# EAGLE schematic chlorophyll_analyzer (EAGLE 9.4.2)
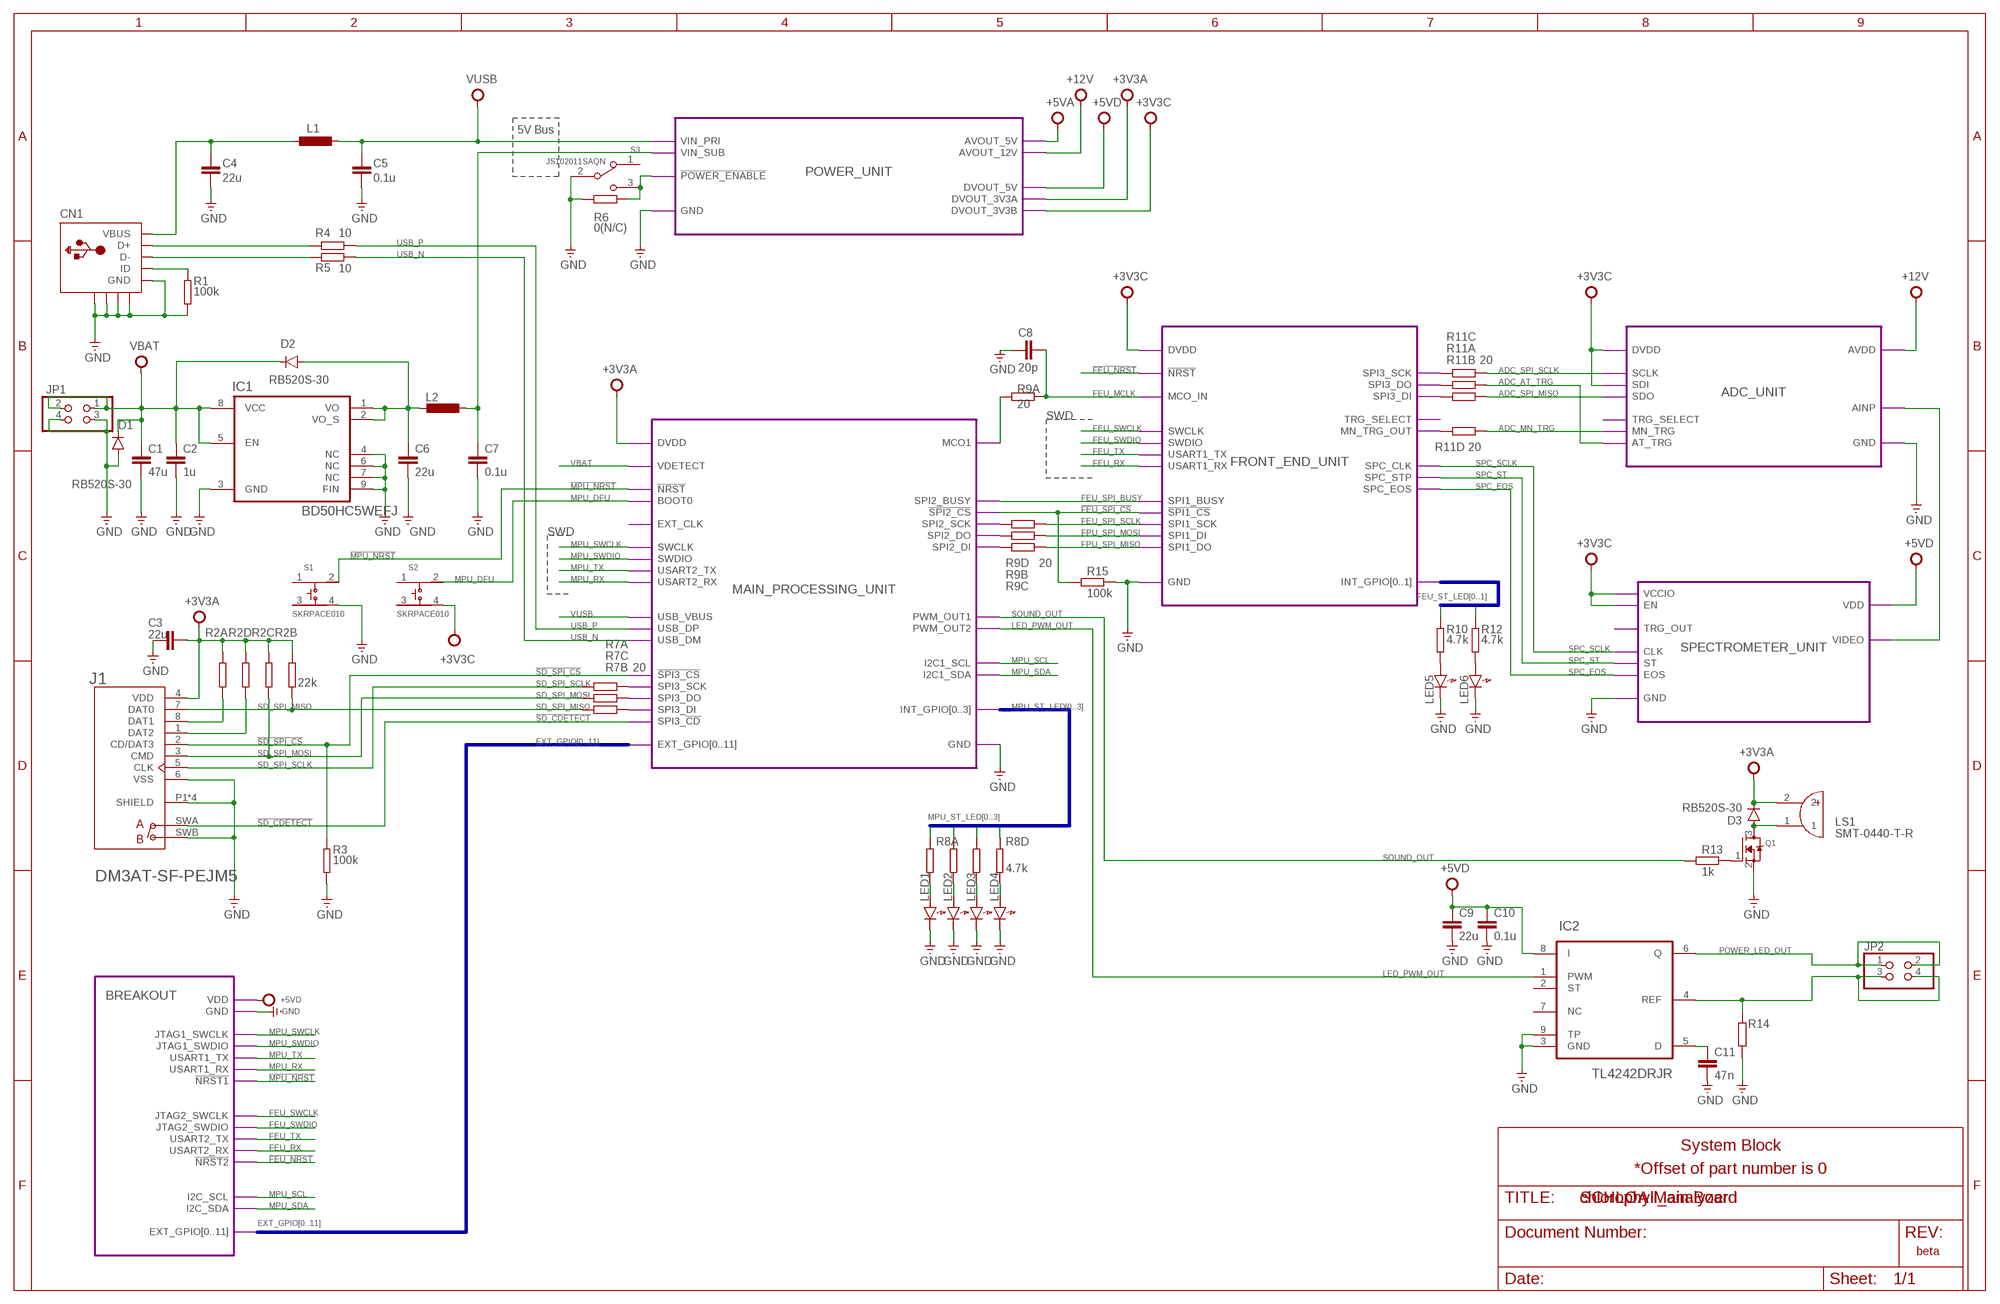
[diagram p0: schematic, sheet 1]

## Parts
C1  47u  C-EUC1206  [C1206]
C2  1u  C-EUC0603K  [C0603K]
C3  22u  C-EUC0603K  [C0603K]
C4  22u  C-EUC0603K  [C0603K]
C5  0.1u  C-EUC0603K  [C0603K]
C6  22u  C-EUC0603K  [C0603K]
C7  0.1u  C-EUC0603K  [C0603K]
C8  20p  C-EUC0603K  [C0603K]
C9  22u  C-EUC0603K  [C0603K]
C10  0.1u  C-EUC0603K  [C0603K]
C11  47n  C-EUC0603K  [C0603K]
CN1  USBMINIB  [USB-MINIB]
D1  RB520S-30  DIODE-SOD523  [SOD523]
D2  RB520S-30  DIODE-SOD523  [SOD523]
D3  RB520S-30  DIODE-SOD523  [SOD523]
IC1  BD50HC5WEFJ  BDXXHC5WEFJ  [HTSOP-J8]
IC2  TL4242DRJR  [SON80P410X410X80-9N]
J1  DM3AT-SF-PEJM5  [HRS_DM3AT-SF-PEJM5]
JP1  PINHD-2X2  [2X02]
JP2  PINHD-2X2  [2X02]
L1  INDUCOR2012  [SMD2012]
L2  INDUCOR2012  [SMD2012]
LED1  LED1608  [LED1608]
LED2  LED1608  [LED1608]
LED3  LED1608  [LED1608]
LED4  LED1608  [LED1608]
LED5  LED1608  [LED1608]
LED6  LED1608  [LED1608]
LS1  SMT-0440-T-R  [XDCR_SMT-0440-T-R]
Q1  MOSFET-NREFLOW  [SOT23]
R1  100k  RESISTOR1608  [SMD1608]
R2  22k  RESISTOR_ARRY1206  [RESCAXS80P320X160X60-8N]
R3  100k  RESISTOR1608  [SMD1608]
R4  10  RESISTOR1608  [SMD1608]
R5  10  RESISTOR1608  [SMD1608]
R6  0(N/C)  RESISTOR1608  [SMD1608]
R7  20  RESISTOR_ARRY1206  [RESCAXS80P320X160X60-8N]
R8  4.7k  RESISTOR_ARRY1206  [RESCAXS80P320X160X60-8N]
R9  20  RESISTOR_ARRY1206  [RESCAXS80P320X160X60-8N]
R10  4.7k  RESISTOR1608  [SMD1608]
R11  20  RESISTOR_ARRY1206  [RESCAXS80P320X160X60-8N]
R12  4.7k  RESISTOR1608  [SMD1608]
R13  1k  RESISTOR1608  [SMD1608]
R14  R-EU_R1206  [R1206]
R15  100k  RESISTOR1608  [SMD1608]
S1  SKRPACE010  [SW_SKRPACE010]
S2  SKRPACE010  [SW_SKRPACE010]
S3  JS102011SAQN  [SW_JS102011SAQN]

## Module instances
ADC_UNIT = ADC_UNIT (part numbers offset by 500)
FRONT_END_UNIT = FRONT_END_UNIT (part numbers offset by 300)
POWER_UNIT = POWER_UNIT (part numbers offset by 100)
SPECTROMETER_UNIT = SPECTROMETER_UNIT (part numbers offset by 400)
MAIN_PROCESSING_UNIT = MAIN_PROCESSING_UNIT (part numbers offset by 200)
BREAKOUT = BREAKOUT (part numbers offset by 600)

## Nets
!FEU_NRST: port FRONT_END_UNIT.!NRST BREAKOUT.!NRST2
!FEU_SPI_CS: R15.1 ; port FRONT_END_UNIT.!SPI1_CS MAIN_PROCESSING_UNIT.!SPI2_CS
!MPU_NRST: S1.2 ; port MAIN_PROCESSING_UNIT.!NRST BREAKOUT.!NRST1
!SD_CDETECT: J1.SWA(A) ; port MAIN_PROCESSING_UNIT.SPI3_!CD
!SD_SPI_CS: J1.2(CD/DAT3) R3.1 ; port MAIN_PROCESSING_UNIT.!SPI3_CS
+3V3A: C3.1 D3.C J1.4(VDD) LS1.2 R2.5 R2.6 R2.7 R2.8 ; port POWER_UNIT.DVOUT_3V3A MAIN_PROCESSING_UNIT.DVDD
+3V3C: S2.4 ; port POWER_UNIT.DVOUT_3V3B ADC_UNIT.DVDD ADC_UNIT.SDI SPECTROMETER_UNIT.VCCIO SPECTROMETER_UNIT.EN FRONT_END_UNIT.DVDD
+5VA: port POWER_UNIT.AVOUT_5V
+5VD: C9.2 C10.2 IC2.8(I) ; port POWER_UNIT.DVOUT_5V BREAKOUT.VDD SPECTROMETER_UNIT.VDD
+12V: port POWER_UNIT.AVOUT_12V ADC_UNIT.AVDD
ADC_AT_TRG: R11.8 ; port ADC_UNIT.AT_TRG
ADC_MN_TRG: R11.5 ; port ADC_UNIT.MN_TRG
ADC_SPI_MISO: R11.7 ; port ADC_UNIT.SDO
ADC_SPI_SCLK: R11.6 ; port ADC_UNIT.SCLK
FEU_MCLK: C8.1 R9.8 ; port FRONT_END_UNIT.MCO_IN
FEU_RX: port FRONT_END_UNIT.USART1_RX BREAKOUT.USART2_RX
FEU_SPI_BUSY: port FRONT_END_UNIT.SPI1_BUSY MAIN_PROCESSING_UNIT.SPI2_BUSY
FEU_SPI_SCLK: R9.5 ; port FRONT_END_UNIT.SPI1_SCK
FEU_ST_LED0: R10.1
FEU_ST_LED1: R12.1
FEU_SWCLK: port FRONT_END_UNIT.SWCLK BREAKOUT.JTAG2_SWCLK
FEU_SWDIO: port FRONT_END_UNIT.SWDIO BREAKOUT.JTAG2_SWDIO
FEU_TX: port FRONT_END_UNIT.USART1_TX BREAKOUT.USART2_TX
FPU_SPI_MISO: R9.6 ; port FRONT_END_UNIT.SPI1_DO
FPU_SPI_MOSI: R9.7 ; port FRONT_END_UNIT.SPI1_DI
GND: C1.2 C2.2 C3.2 C4.2 C5.2 C6.2 C7.2 C8.2 C9.1 C10.1 C11.1 CN1.GND CN1.GND1 CN1.GND2 CN1.GND3 CN1.GND4 D1.A IC1.3(GND) IC1.4(NC) IC1.6(NC) IC1.7(NC) IC1.9(FIN) IC2.3(GND) IC2.9(TP) J1.6(VSS) J1.P1(SHIELD) J1.P2(SHIELD) J1.P3(SHIELD) J1.P4(SHIELD) J1.SWB(B) JP1.3 JP1.4 LED1.K LED2.K LED3.K LED4.K LED5.K LED6.K Q1.2(S) R1.2 R3.2 R6.1 R14.1 R15.2 S1.4 S3.2 ; port POWER_UNIT.GND ADC_UNIT.GND SPECTROMETER_UNIT.GND MAIN_PROCESSING_UNIT.GND FRONT_END_UNIT.GND BREAKOUT.GND
LED_PWM_OUT: IC2.1(PWM) ; port MAIN_PROCESSING_UNIT.PWM_OUT2
MPU_DFU: S2.2 ; port MAIN_PROCESSING_UNIT.BOOT0
MPU_RX: port MAIN_PROCESSING_UNIT.USART2_RX BREAKOUT.USART1_RX
MPU_SCL: port MAIN_PROCESSING_UNIT.I2C1_SCL BREAKOUT.I2C_SCL
MPU_SDA: port MAIN_PROCESSING_UNIT.I2C1_SDA BREAKOUT.I2C_SDA
MPU_ST_LED0: R8.1
MPU_ST_LED1: R8.2
MPU_ST_LED2: R8.3
MPU_ST_LED3: R8.4
MPU_SWCLK: port MAIN_PROCESSING_UNIT.SWCLK BREAKOUT.JTAG1_SWCLK
MPU_SWDIO: port MAIN_PROCESSING_UNIT.SWDIO BREAKOUT.JTAG1_SWDIO
MPU_TX: port MAIN_PROCESSING_UNIT.USART2_TX BREAKOUT.USART1_TX
N$1: LED1.A R8.8
N$2: LED2.A R8.7
N$3: LED3.A R8.6
N$4: LED4.A R8.5
N$5: J1.8(DAT1) R2.1
N$6: J1.1(DAT2) R2.4
N$7: C6.1 D2.A IC1.1(VO) IC1.2(VO_S) L2.2
N$8: LED5.A R10.2
N$9: Q1.1(G) R13.2
N$10: C4.1 CN1.VBUS L1.2
N$11: R6.2 S3.3 ; port POWER_UNIT.!POWER_ENABLE
N$12: LED6.A R12.2
N$13: C11.2 IC2.5(D)
N$14: D3.A LS1.1 Q1.3(D)
N$16: R9.4 ; port MAIN_PROCESSING_UNIT.SPI2_SCK
N$17: C7.1 L2.1 ; port POWER_UNIT.VIN_SUB
N$18: R7.8 ; port MAIN_PROCESSING_UNIT.SPI3_SCK
N$19: R7.6 ; port MAIN_PROCESSING_UNIT.SPI3_DO
N$20: IC2.4(REF) JP2.3 JP2.4 R14.2
N$21: port SPECTROMETER_UNIT.VIDEO ADC_UNIT.AINP
N$22: R7.7 ; port MAIN_PROCESSING_UNIT.SPI3_DI
N$23: R9.2 ; port MAIN_PROCESSING_UNIT.SPI2_DO
N$24: R9.3 ; port MAIN_PROCESSING_UNIT.SPI2_DI
N$25: R9.1 ; port MAIN_PROCESSING_UNIT.MCO1
N$26: R11.1 ; port FRONT_END_UNIT.SPI3_DO
N$27: R11.2 ; port FRONT_END_UNIT.SPI3_DI
N$28: R11.3 ; port FRONT_END_UNIT.SPI3_SCK
N$29: R11.4 ; port FRONT_END_UNIT.MN_TRG_OUT
N$30: CN1.ID R1.1
POWER_LED_OUT: IC2.6(Q) JP2.1 JP2.2
SD_SPI_MISO: J1.7(DAT0) R2.2 R7.2
SD_SPI_MOSI: J1.3(CMD) R2.3 R7.3
SD_SPI_SCLK: J1.5(CLK) R7.1
SOUND_OUT: R13.1 ; port MAIN_PROCESSING_UNIT.PWM_OUT1
SPC_EOS: port SPECTROMETER_UNIT.EOS FRONT_END_UNIT.SPC_EOS
SPC_SCLK: port SPECTROMETER_UNIT.CLK FRONT_END_UNIT.SPC_CLK
SPC_ST: port SPECTROMETER_UNIT.ST FRONT_END_UNIT.SPC_STP
USB_N: R5.2 ; port MAIN_PROCESSING_UNIT.USB_DM
USB_P: R4.2 ; port MAIN_PROCESSING_UNIT.USB_DP
USBC_N: CN1.D- R5.1
USBC_P: CN1.D+ R4.1
VBAT: C1.1 C2.1 D1.C D2.C IC1.5(EN) IC1.8(VCC) JP1.1 JP1.2 ; port MAIN_PROCESSING_UNIT.VDETECT
VUSB: C5.1 L1.1 ; port POWER_UNIT.VIN_PRI MAIN_PROCESSING_UNIT.USB_VBUS
Unconnected: IC2.2(ST) IC2.7(NC) R7.4 R7.5 S1.1 S1.3 S2.1 S2.3 S3.1

## Buses
MPU_ST_LED[0..3]
FEU_ST_LED[0..1]
EXT_GPIO[0..11]

## Notes on the sheet
- 5V Bus
- SWD
- SWD
- System Block
- *Offset of part number is 0
- SCHLOA Main Board
- beta

## Library data of the parts
C1-C11 = rcl:C-EU: CAPACITOR, European symbol; SPICEPREFIX: C
CN1 = adafruit:USB: USB Connectors USBMINIB - Surface Mount Female Mini-B USB Connector 4UConnector: 06564 By microbuilder.eu Thru-hole RA Female Mini-B USB Connector 4UConnector: 18732 By ladyada.net
D1-D3 = diode:DIODE-: DIODE
IC1 = BDxxHC5WEFJ:BDXXHC5WEFJ: 1.5A LDO Regulator
IC2 = TL4242DRJR:TL4242DRJR: ADJUSTABLE LED DRIVER; AVAILABILITY: Unavailable; DESCRIPTION: LED DRVR 5V/9V/12V/15V/18V/24V 8-Pin WSON EP T/R; MF: Texas Instruments; MP: TL4242DRJR; PACKAGE: WSON-8 Texas Instruments; PRICE: None
J1 = DM3AT-SF-PEJM5:DM3AT-SF-PEJM5: DM3 Series 8 Position Right Angle SMT Push Push Ejection MicroSD Card Connector; AVAILABILITY: Unavailable; DESCRIPTION: DM3 RA SMT microSD memory card push/push; MF: Hirose; MP: DM3AT-SF-PEJM5; PACKAGE: None; PRICE: None
JP1 JP2 = pinhead:PINHD-2X2: PIN HEADER
L1 L2 = Fugu_RCL:INDUCOR
LED1-LED6 = Fugu_RCL:LED: Generic LEDs
LS1 = SMT-0440-T-R:SMT-0440-T-R: Audio Indicator Transducer Electromagnetic 3Vpk 90mA Solder Pad 2Vpk 3500Hz to 4500Hz Surface Mount; DESCRIPTION: Audio Indicator Transducer Electromagnetic 3Vpk 90mA Solder Pad 2Vpk 3500Hz to 4500Hz Surface Mount; DIGI-KEY_PART_NUMBER: 668-1489-1-ND; DIGI-KEY_PURCHASE_URL: https://www.digikey.jp/product-detail/en/pui-audio-inc/SMT-0440-T-R/668-1489-1-ND/5113610?utm_source=snapeda&utm_medium=aggregator&utm_campaign=symbol; MF: PUI; MP: SMT-0440-T-R; PACKAGE: PUI
Q1 = adafruit:MOSFET-N: N-Channel Mosfet 2N7002E - 60V 260mA SOT23 [Digikey: 2N7002ET1GOSTR-ND] - REEL BSH103 - 30V 850mA SOT23 [Digikey: 568-5013-1-ND]
R1 R3-R6 R10 R12 R13 R15 = Fugu_RCL:RESISTOR: Generic Registor
R2 R9 = Fugu_RCL:RESISTOR_ARRY; SPICEPREFIX: R
R7 R8 R11 = Fugu_RCL:RESISTOR_ARRY
R14 = rcl:R-EU_: RESISTOR, European symbol; SPICEPREFIX: R
S1 S2 = SKRPACE010:SKRPACE010: Switch Tactile N.O. SPST Button J-Bend 0.05A 16VDC 2.55N SMD Automotive T/R; AVAILABILITY: Unavailable; DESCRIPTION: Switch Tactile N.O. SPST Button J-Bend 0.05A 16VDC 2.55N SMD Automotive T/R; MF: ALPS; MP: SKRPACE010; PACKAGE: None; PRICE: None; SPICEPREFIX: S
S3 = JS102011SAQN:JS102011SAQN: JS10 Series SPDT On-On 6 V 0.3 A Gull Wing SMT Slide Switch http://www.snapeda.com/parts/JS102011SAQN/C%26K%20Components/view-part/; AVAILABILITY: Unavailable; DESCRIPTION: JS10 Series SPDT On-On 6 V 0.3 A Gull Wing SMT Slide Switch; MF: C&K; MP: JS102011SAQN; PACKAGE: None; PRICE: None

## Module ADC_UNIT
Ports: SCLK(in) SDO(out) SDI(in) DVDD(pwr) AVDD(pwr) GND(pwr) TRG_SELECT(in) AT_TRG(in) MN_TRG(in) AINP(in)
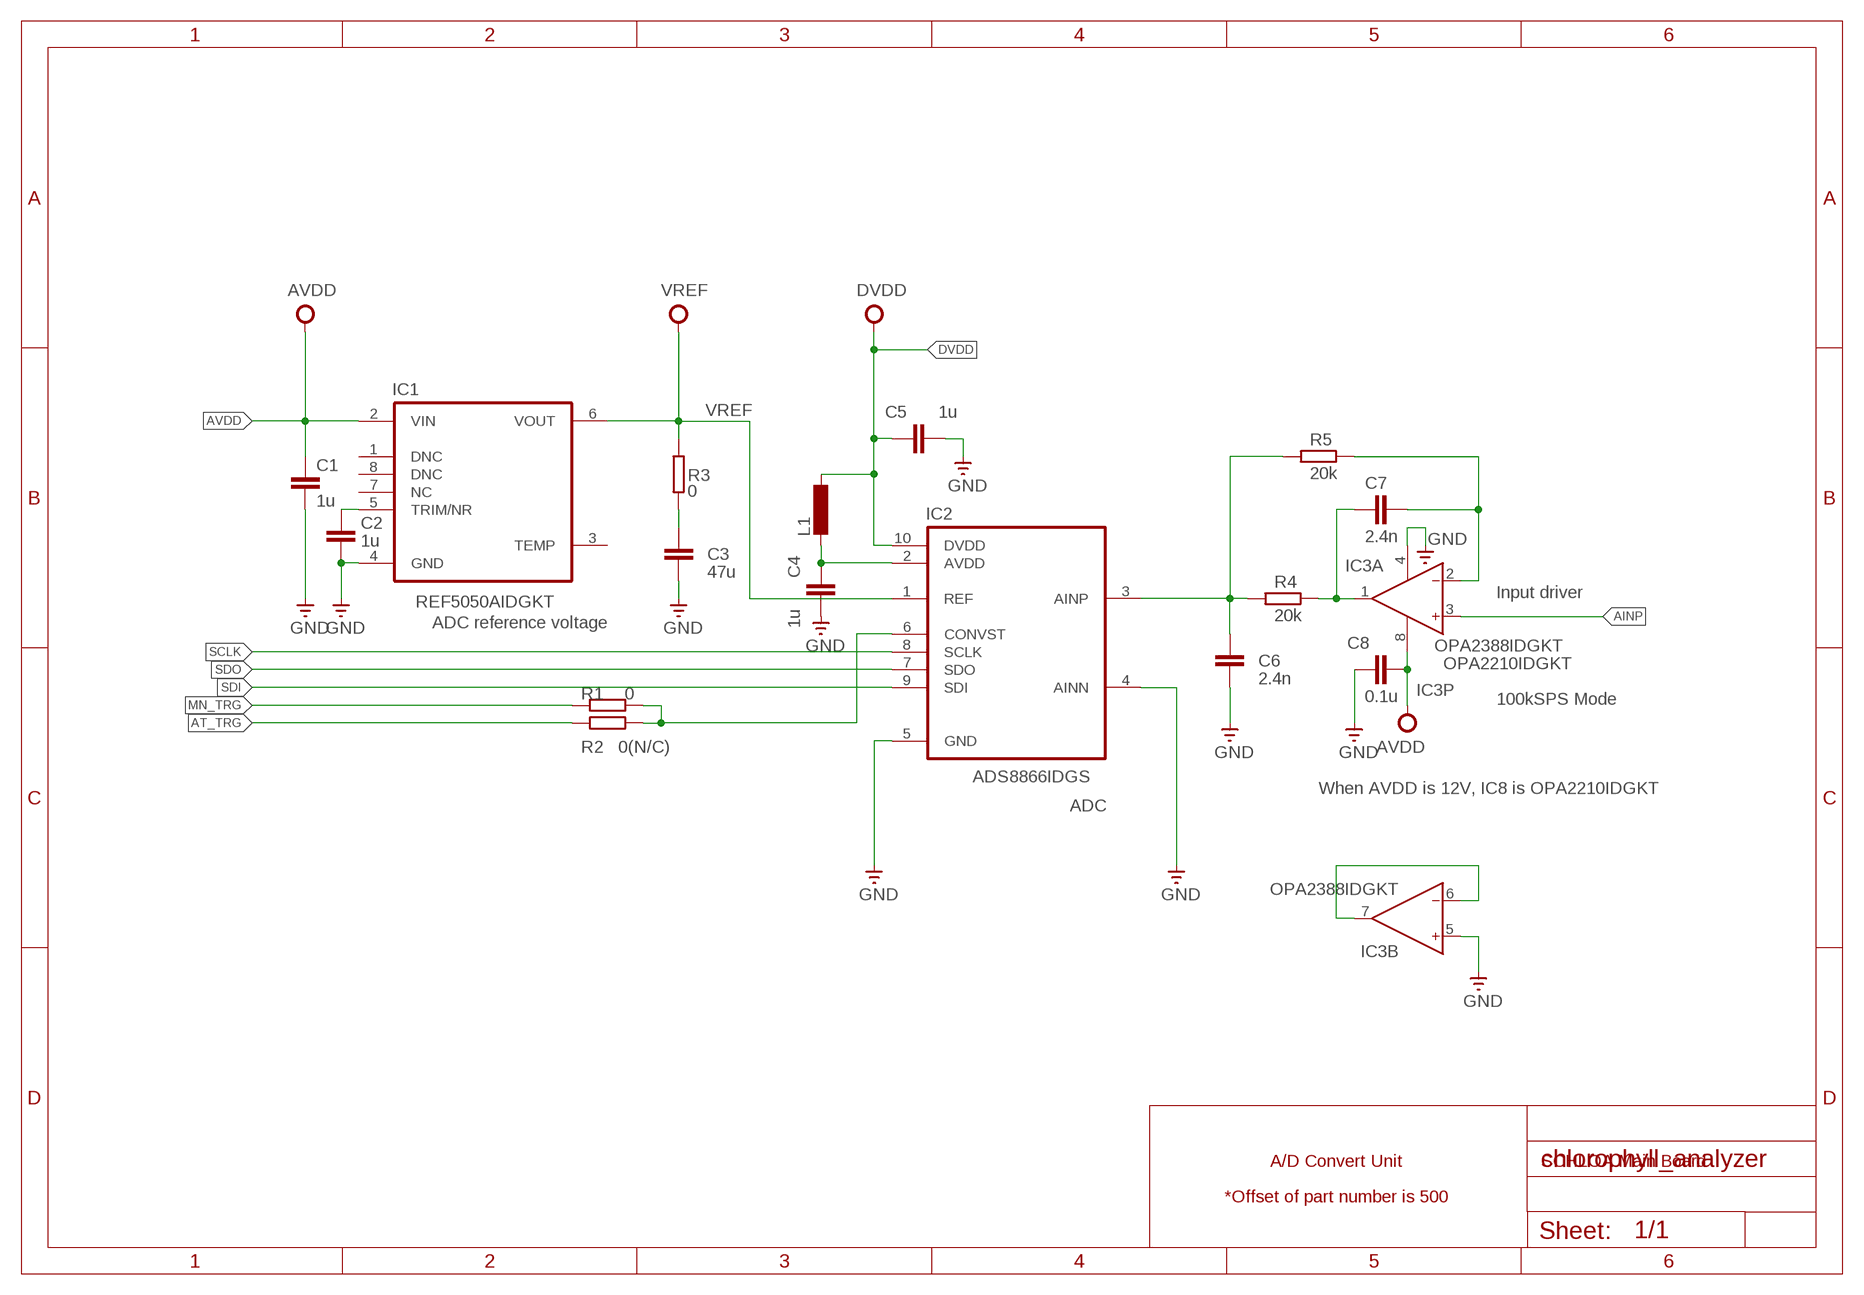
[diagram p1: schematic, module ADC_UNIT, sheet 1]

### Parts
C1  1u  C-EUC0603K  [C0603K]
C2  1u  C-EUC0603K  [C0603K]
C3  47u  C-EUC1206  [C1206]
C4  1u  C-EUC0603K  [C0603K]
C5  1u  C-EUC0603K  [C0603K]
C6  2.4n  C-EUC0603K  [C0603K]
C7  2.4n  C-EUC0603K  [C0603K]
C8  0.1u  C-EUC0603K  [C0603K]
IC1  REF5050AIDGKT  [SOP65P490X110-8N]
IC2  ADS8866IDGS  ADS8319IBDGSR  [SOP50P490X110-10N]
IC3  OPA2388IDGKT  [SOP65P490X110-9N]
L1  INDUCOR1608  [SMD1608]
R1  0  REGISTER1068  [SMD1608]
R2  0(N/C)  REGISTER1068  [SMD1608]
R3  0  RESISTOR1608  [SMD1608]
R4  20k  RESISTOR1608  [SMD1608]
R5  20k  RESISTOR1608  [SMD1608]

### Nets
ADC_CTRG: IC2.6(CONVST) R1.2 R2.2
AINP: IC3.3(A:IN+)
AT_TRG: R2.1
AVDD: C1.1 C8.1 IC1.2(VIN) IC3.8(P:V+)
DVDD: C5.1 IC2.10(DVDD) L1.1
GND: C1.2 C2.2 C3.1 C4.2 C5.2 C6.2 C8.2 IC1.4(GND) IC2.4(AINN) IC2.5(GND) IC3.4(P:V-) IC3.5(B:IN+)
MN_TRG: R1.1
N$1: C3.2 R3.1
N$2: IC3.6(B:IN-) IC3.7(B:OUT)
N$3: C4.1 IC2.2(AVDD) L1.2
N$25: C6.1 IC2.3(AINP) R4.1 R5.1
N$26: C7.1 IC3.1(A:OUT) R4.2
N$30: C7.2 IC3.2(A:IN-) R5.2
N$34: C2.1 IC1.5(TRIM/NR)
SCLK: IC2.8(SCLK)
SDI: IC2.9(SDI)
SDO: IC2.7(SDO)
VREF: IC1.6(VOUT) IC2.1(REF) R3.2
Unconnected: IC1.1(DNC) IC1.3(TEMP) IC1.7(NC) IC1.8(DNC)

### Notes on the sheet
- Input driver
- ADC reference voltage
- OPA2210IDGKT
- 100kSPS Mode
- When AVDD is 12V, IC8 is OPA2210IDGKT
- ADC
- A/D Convert Unit | SCHLOA Main Board
- *Offset of part number is 500

### Library data of the parts
C1-C8 = rcl:C-EU: CAPACITOR, European symbol; SPICEPREFIX: C
IC1 = REF5050AIDGKT:REF5050AIDGKT: VOLTAGE REFERENCE; AVAILABILITY: Unavailable; DESCRIPTION: VOLTAGE REFERENCE, SERIES, 5V, MSOP-8; Topology: Series; Input Voltage Min: 5.2V;; MF: Texas Instruments; MP: REF5050AIDGKT; PACKAGE: MSOP-8 Texas Instruments; PRICE: None; SPICEPREFIX: X
IC2 = ADS8319IBDGSR:ADS8319IBDGSR: ADC; DESCRIPTION: Precision 16-Bit SAR w/ SPI interface in MSOP-10 10-VSSOP -40 to 85; DIGI-KEY_PART_NUMBER: ADS8319IBDGSR-ND; DIGI-KEY_PURCHASE_URL: https://www.digikey.com/product-detail/en/texas-instruments/ADS8319IBDGSR/ADS8319IBDGSR-ND/2047198?utm_source=snapeda&utm_medium=aggregator&utm_campaign=symbol; MF: Texas Instruments; MP: ADS8319IBDGSR; PACKAGE: MSOP-10 Texas Instruments
IC3 = OPA2388IDGKT:OPA2388IDGKT: Single Supplｙ True Rail-to-Rail Operational Amplifiers; AVAILABILITY: Uavailable; MF: Texsas Instruments; MP: OPA2388IDGKT; PACKAGE: MSOP-8 Texas Instruments; PRICE: None
L1 = Fugu_RCL:INDUCOR
R1 = Fugu_Generic:REGISTER
R2 = Fugu_Generic:REGISTER; SPICEPREFIX: R
R3-R5 = Fugu_RCL:RESISTOR: Generic Registor

## Module FRONT_END_UNIT
Ports: DVDD(pwr) GND(pwr) !NRST(in) SWCLK(in) SWDIO(io) USART1_RX(in) MCO_IN(in) SPI1_BUSY(out) !SPI1_CS(in) SPI1_SCK(in) SPI1_DO(out) SPI1_DI(in) USART1_TX(out) SPI3_DI(in) SPI3_SCK(out) SPI3_DO(out) MN_TRG_OUT(out) TRG_SELECT(out) SPC_CLK(out) SPC_STP(out) SPC_EOS(in) INT_GPIO[0..1](io)
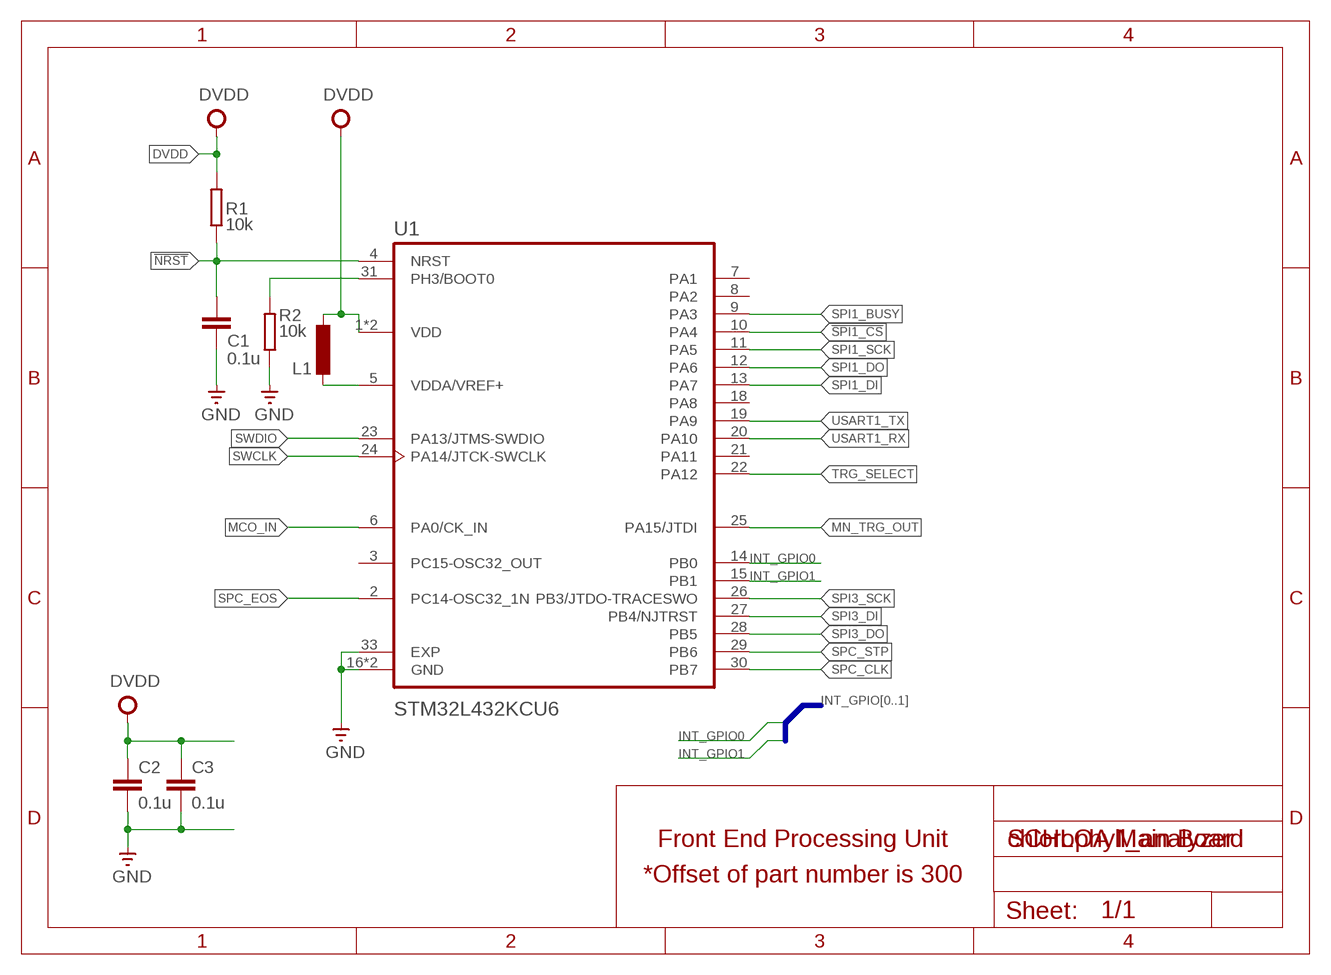
[diagram p2: schematic, module FRONT_END_UNIT, sheet 1]

### Parts
C1  0.1u  C-EUC0603K  [C0603K]
C2  0.1u  C-EUC0603K  [C0603K]
C3  0.1u  C-EUC0603K  [C0603K]
L1  INDUCOR1608  [SMD1608]
R1  10k  RESISTOR1608  [SMD1608]
R2  10k  RESISTOR1608  [SMD1608]
U1  STM32L432KCU6  [QFN50P500X500X60-33N]

### Nets
!NRST: C1.1 R1.2 U1.4(NRST)
!SPI1_CS: U1.10(PA4)
DVDD: C2.1 C3.1 L1.1 R1.1 U1.1(VDD) U1.17(VDD)
GND: C1.2 C2.2 C3.2 R2.2 U1.16(GND) U1.32(GND) U1.33(EXP)
INT_GPIO0: U1.14(PB0)
INT_GPIO1: U1.15(PB1)
MCO_IN: U1.6(PA0/CK_IN)
MN_TRG_OUT: U1.25(PA15/JTDI)
N$1: L1.2 U1.5(VDDA/VREF+)
N$10: R2.1 U1.31(PH3/BOOT0)
SPC_CLK: U1.30(PB7)
SPC_EOS: U1.2(PC14-OSC32_1N)
SPC_STP: U1.29(PB6)
SPI1_BUSY: U1.9(PA3)
SPI1_DI: U1.13(PA7)
SPI1_DO: U1.12(PA6)
SPI1_SCK: U1.11(PA5)
SPI3_DI: U1.27(PB4/NJTRST)
SPI3_DO: U1.28(PB5)
SPI3_SCK: U1.26(PB3/JTDO-TRACESWO)
SWCLK: U1.24(PA14/JTCK-SWCLK)
SWDIO: U1.23(PA13/JTMS-SWDIO)
TRG_SELECT: U1.22(PA12)
USART1_RX: U1.20(PA10)
USART1_TX: U1.19(PA9)
Unconnected: U1.3(PC15-OSC32_OUT) U1.7(PA1) U1.8(PA2) U1.18(PA8) U1.21(PA11)

### Buses
INT_GPIO[0..1]

### Notes on the sheet
- Front End Processing Unit | SCHLOA Main Board
- *Offset of part number is 300

### Library data of the parts
C1-C3 = rcl:C-EU: CAPACITOR, European symbol; SPICEPREFIX: C
L1 = Fugu_RCL:INDUCOR
R1 R2 = Fugu_RCL:RESISTOR: Generic Registor
U1 = STM32L432KCU6:STM32L432KCU6: None; AVAILABILITY: Unavailable; DESCRIPTION: MCU 32-bit STM32L ARM Cortex M4 RISC 256KB Flash 2.5V/3.3V 32-Pin UFQFPN EP Tray; MF: STMicroelectronics; MP: STM32L432KCU6; PACKAGE: UFQFN-32 STMicroelectronics; PRICE: None

## Module POWER_UNIT
Ports: !POWER_ENABLE(pwr) GND(pwr) VIN_PRI(pwr) VIN_SUB(pwr) AVOUT_5V(pwr) DVOUT_5V(pwr) DVOUT_3V3A(pwr) DVOUT_3V3B(pwr) AVOUT_12V(pwr)
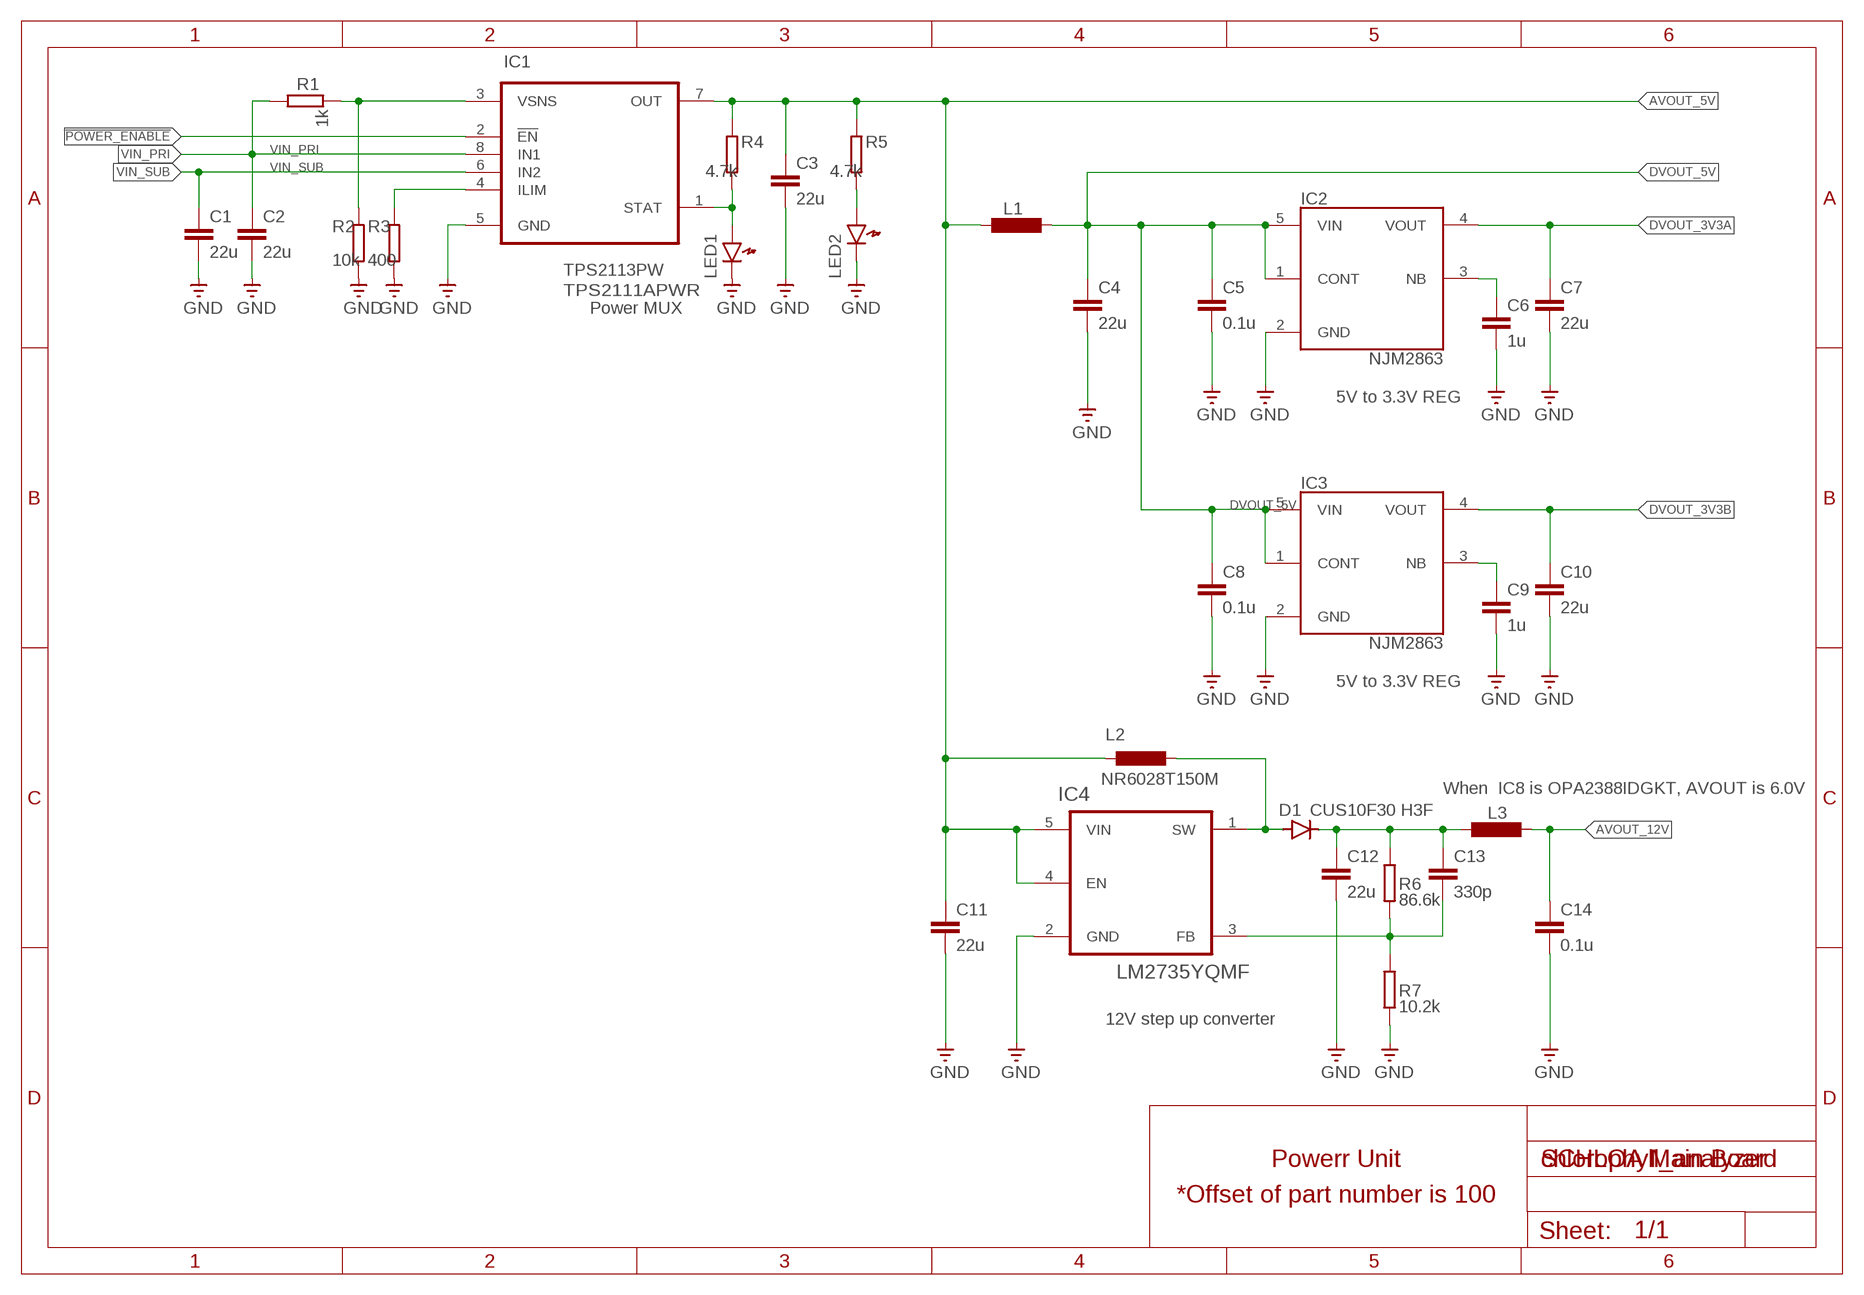
[diagram p3: schematic, module POWER_UNIT, sheet 1]

### Parts
C1  22u  C-EUC0603K  [C0603K]
C2  22u  C-EUC0603K  [C0603K]
C3  22u  C-EUC0603K  [C0603K]
C4  22u  C-EUC0603K  [C0603K]
C5  0.1u  C-EUC0603K  [C0603K]
C6  1u  C-EUC0603K  [C0603K]
C7  22u  C-EUC0603K  [C0603K]
C8  0.1u  C-EUC0603K  [C0603K]
C9  1u  C-EUC0603K  [C0603K]
C10  22u  C-EUC0603K  [C0603K]
C11  22u  C-EUC0603K  [C0603K]
C12  22u  C-EUC0603K  [C0603K]
C13  330p  C-EUC0603K  [C0603K]
C14  0.1u  C-EUC0603K  [C0603K]
D1  CUS10F30 H3F  DIODE-SOD323-W  [SOD323-W]
IC1  TPS2113PW  [SOP65P640X120-8N]
IC2  NJM2863  [SOT-23-5]
IC3  NJM2863  [SOT-23-5]
IC4  LM2735YQMF  [SOT65P285X120-5N]
L1  INDUCOR2012  [SMD2012]
L2  NR6028T150M  [IND_TAIYO_NR6028]
L3  INDUCOR2012  [SMD2012]
LED1  LED1608  [LED1608]
LED2  LED1608  [LED1608]
R1  1k  RESISTOR1608  [SMD1608]
R2  10k  RESISTOR1608  [SMD1608]
R3  400  RESISTOR1608  [SMD1608]
R4  4.7k  RESISTOR1608  [SMD1608]
R5  4.7k  RESISTOR1608  [SMD1608]
R6  86.6k  RESISTOR1608  [SMD1608]
R7  10.2k  RESISTOR1608  [SMD1608]

### Nets
!POWER_ENABLE: IC1.2(!EN)
AVOUT_5V: C3.1 C11.1 IC1.7(OUT) IC4.4(EN) IC4.5(VIN) L1.2 L2.2 R4.1 R5.1
AVOUT_12V: C14.1 L3.1
DVOUT_3V3A: C7.1 IC2.4(VOUT)
DVOUT_3V3B: C10.1 IC3.4(VOUT)
DVOUT_5V: C4.1 C5.1 C8.1 IC2.1(CONT) IC2.5(VIN) IC3.1(CONT) IC3.5(VIN) L1.1
GND: C1.2 C2.2 C3.2 C4.2 C5.2 C6.2 C7.2 C8.2 C9.2 C10.2 C11.2 C12.2 C14.2 IC1.5(GND) IC2.2(GND) IC3.2(GND) IC4.2(GND) LED1.K LED2.K R2.2 R3.2 R7.1
N$2: IC1.3(VSNS) R1.2 R2.1
N$3: IC1.4(ILIM) R3.1
N$4: C6.1 IC2.3(NB)
N$5: LED2.A R5.2
N$6: C9.1 IC3.3(NB)
N$7: C12.1 C13.1 D1.C L3.2 R6.2
N$8: D1.A IC4.1(SW) L2.1
N$9: C13.2 IC4.3(FB) R6.1 R7.2
SUP_CH_STAT1: IC1.1(STAT) LED1.A R4.2
VIN_PRI: C2.1 IC1.8(IN1) R1.1
VIN_SUB: C1.1 IC1.6(IN2)

### Notes on the sheet
- TPS2111APWR
- Power MUX
- 5V to 3.3V REG
- 5V to 3.3V REG
- When  IC8 is OPA2388IDGKT, AVOUT is 6.0V
- 12V step up converter
- Powerr Unit | SCHLOA Main Board
- *Offset of part number is 100

### Library data of the parts
C1-C14 = rcl:C-EU: CAPACITOR, European symbol; SPICEPREFIX: C
D1 = diode:DIODE-: DIODE
IC1 = TPS2113PW:TPS2113PW: AUTOSWITCHING POWER MUX; DESCRIPTION: Power Muxes and Current Limited Switches Dual In/Single Out Autoswitch Power MUX; DIGI-KEY_PART_NUMBER: 296-14205-5-ND; DIGI-KEY_PURCHASE_URL: https://www.digikey.com/product-detail/en/texas-instruments/TPS2113PW/296-14205-5-ND/526040?utm_source=snapeda&utm_medium=aggregator&utm_campaign=symbol; MF: Texas Instruments; MP: TPS2113PW; PACKAGE: TSSOP-8 Texas Instruments
IC2 IC3 = Fugu_LSI:NJM2863: Low Noize Low Drop Out Voltage Regulator
IC4 = LM2735YQMF:LM2735YQMF: SEPIC DC-DC Regulatoe; AVAILABILITY: Unavailable; DESCRIPTION: 520kHz/1.6MHz - Space-Efficient Boost and SEPIC DC-DC Regulator 5-SOT-23 -40 to 125; MF: Texas Instruments; MP: LM2735YQMF/NOPB; PACKAGE: SOT-23 Texas Instruments; PRICE: None
L1 L3 = Fugu_RCL:INDUCOR
L2 = NR6028T:NR6028T150M; MANUFACTURER_PART_NUMBER: NR6028T150M; VENDOR: TAIYO YUDEN
LED1 LED2 = Fugu_RCL:LED: Generic LEDs
R1-R7 = Fugu_RCL:RESISTOR: Generic Registor

## Module MAIN_PROCESSING_UNIT
Ports: DVDD(pwr) GND(pwr) !NRST(in) SWCLK(in) SWDIO(io) USART2_TX(out) USART2_RX(in) USB_DM(io) USB_DP(io) USB_VBUS(in) SPI3_SCK(out) SPI3_DO(out) SPI3_DI(in) VDETECT(in) !SPI3_CS(out) EXT_CLK(in) MCO1(out) SPI2_BUSY(in) !SPI2_CS(out) SPI2_SCK(out) SPI2_DO(out) SPI2_DI(in) PWM_OUT1(out) PWM_OUT2(out) INT_GPIO[0..3](io) EXT_GPIO[0..11](io) I2C1_SCL(io) I2C1_SDA(io) SPI3_!CD(in) BOOT0(in)
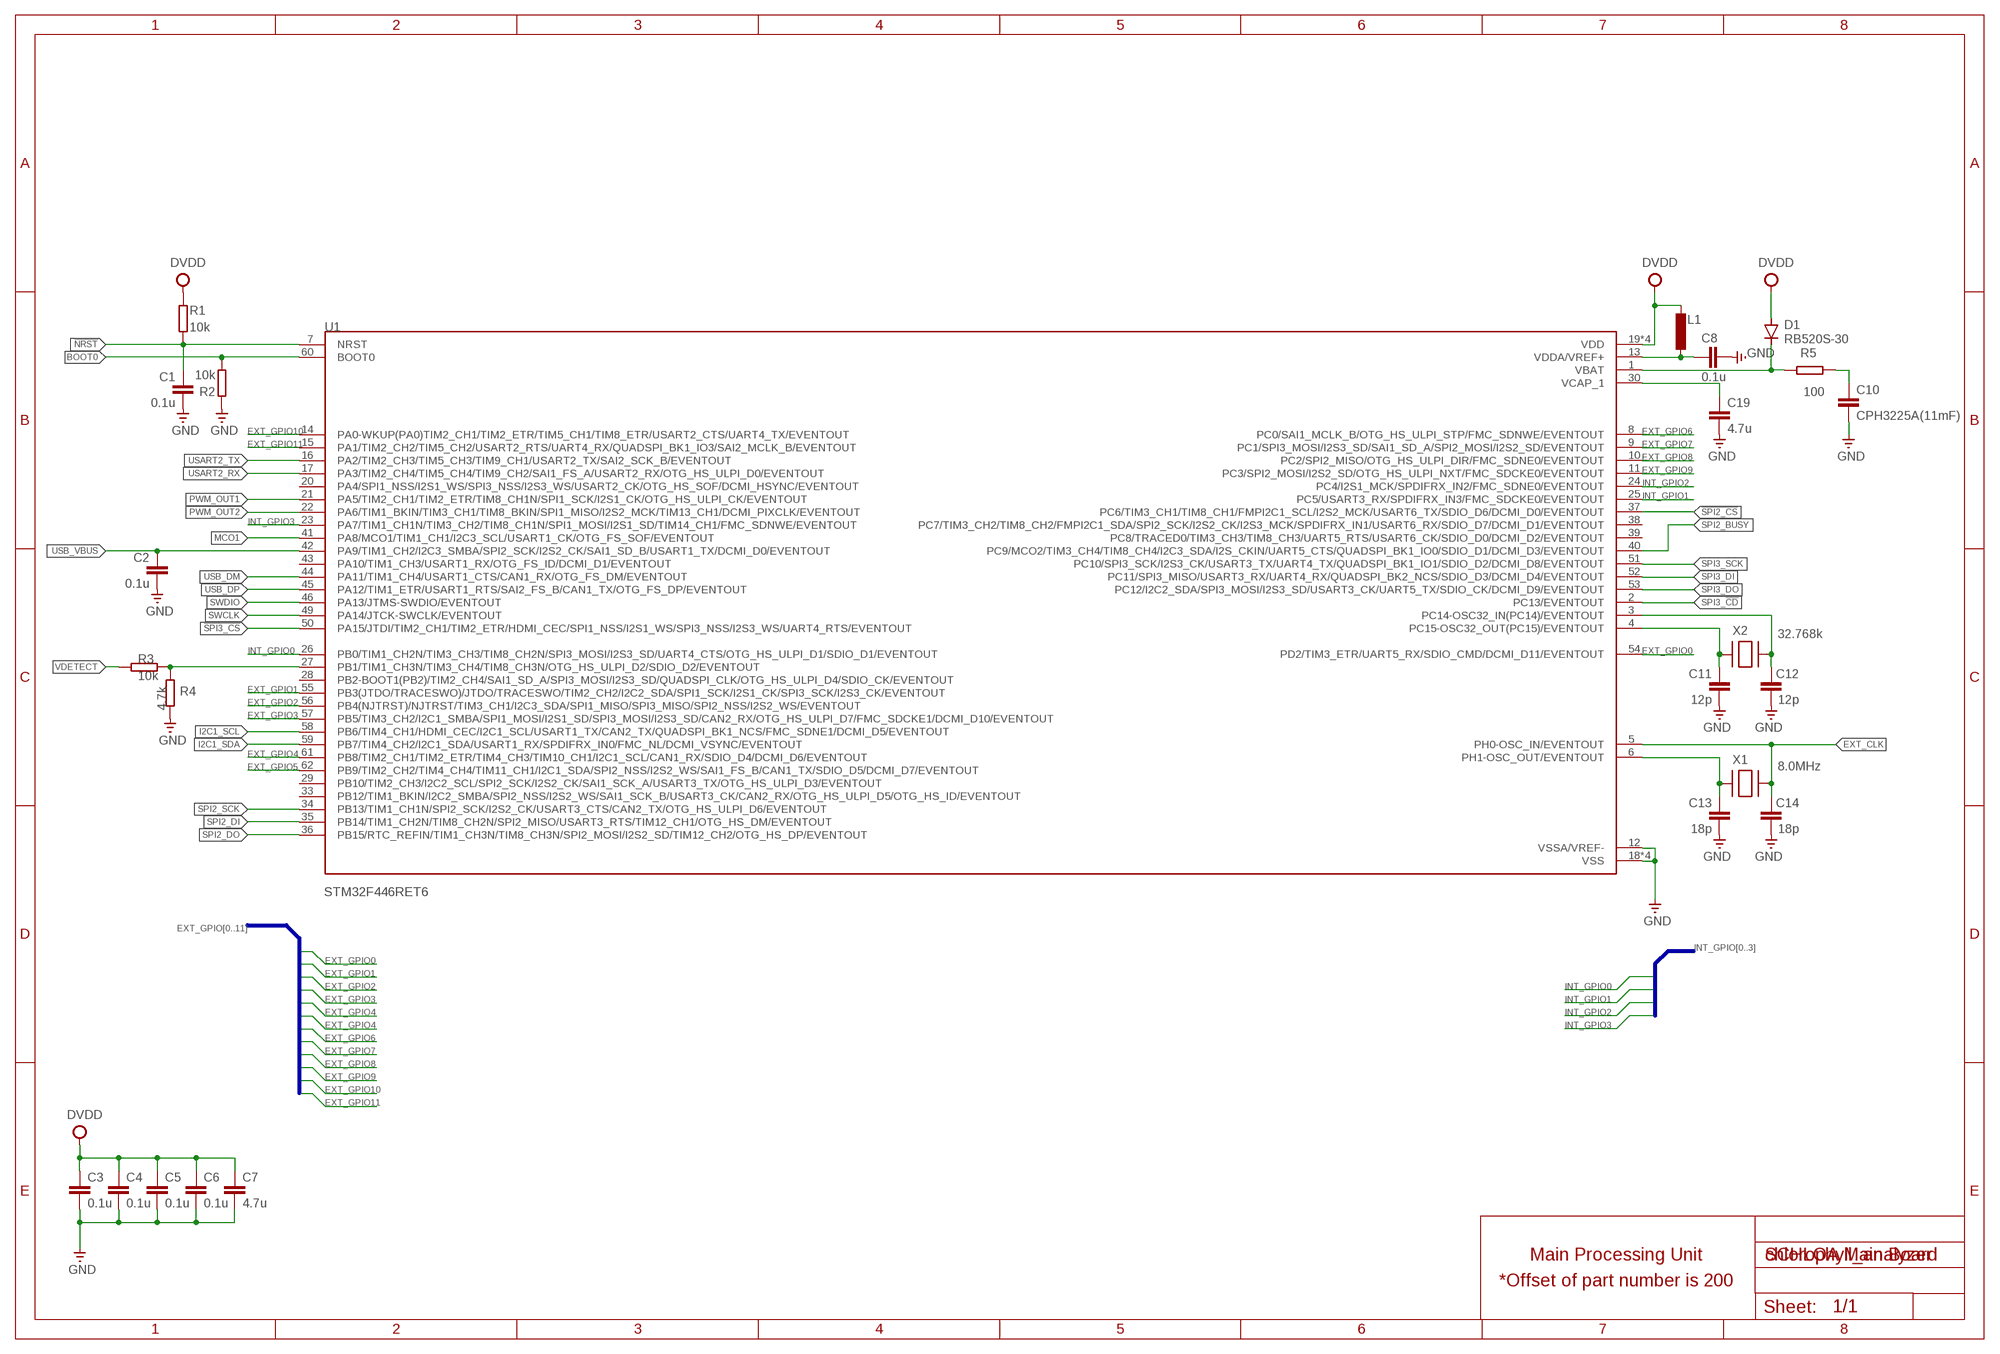
[diagram p4: schematic, module MAIN_PROCESSING_UNIT, sheet 1]

### Parts
C1  0.1u  C-EUC0603K  [C0603K]
C2  0.1u  C-EUC0603K  [C0603K]
C3  0.1u  C-EUC0603K  [C0603K]
C4  0.1u  C-EUC0603K  [C0603K]
C5  0.1u  C-EUC0603K  [C0603K]
C6  0.1u  C-EUC0603K  [C0603K]
C7  4.7u  C-EUC0603K  [C0603K]
C8  0.1u  C-EUC0603K  [C0603K]
C10  CPH3225A(11mF)  C-EUC1210K  [C1210K]
C11  12p  C-EUC0603K  [C0603K]
C12  12p  C-EUC0603K  [C0603K]
C13  18p  C-EUC0603K  [C0603K]
C14  18p  C-EUC0603K  [C0603K]
C19  4.7u  C-EUC0603K  [C0603K]
D1  RB520S-30  DIODE-SOD523  [SOD523]
L1  INDUCOR1608  [SMD1608]
R1  10k  RESISTOR1608  [SMD1608]
R2  10k  RESISTOR1608  [SMD1608]
R3  10k  RESISTOR1608  [SMD1608]
R4  4.7k  RESISTOR1608  [SMD1608]
R5  100  RESISTOR1608  [SMD1608]
U1  STM32F446RET6  [QFP50P1200X1200X160-64N]
X1  8.0MHz  XTALNX5032  [NX5032]
X2  32.768k  XTAL-3.2X1.5  [XTAL3215]

### Nets
!NRST: C1.2 R1.2 U1.7(NRST)
!SPI2_CS: U1.37(PC6/TIM3_CH1/TIM8_CH1/FMPI2C1_SCL/I2S2_MCK/USART6_TX/SDIO_D6/DCMI_D0/EVENTOUT)
!SPI3_CS: U1.50(PA15/JTDI/TIM2_CH1/TIM2_ETR/HDMI_CEC/SPI1_NSS/I2S1_WS/SPI3_NSS/I2S3_WS/UART4_RTS/EVENTOUT)
BOOT0: R2.2 U1.60(BOOT0)
DVDD: C3.1 C4.1 C5.1 C6.1 C7.1 D1.A L1.1 R1.1 U1.19(VDD) U1.32(VDD) U1.48(VDD) U1.64(VDD)
EXT_CLK: C14.1 U1.5(PH0-OSC_IN/EVENTOUT) X1.P$1
EXT_GPIO0: U1.54(PD2/TIM3_ETR/UART5_RX/SDIO_CMD/DCMI_D11/EVENTOUT)
EXT_GPIO1: U1.55(PB3(JTDO/TRACESWO)/JTDO/TRACESWO/TIM2_CH2/I2C2_SDA/SPI1_SCK/I2S1_CK/SPI3_SCK/I2S3_CK/EVENTOUT)
EXT_GPIO2: U1.56(PB4(NJTRST)/NJTRST/TIM3_CH1/I2C3_SDA/SPI1_MISO/SPI3_MISO/SPI2_NSS/I2S2_WS/EVENTOUT)
EXT_GPIO3: U1.57(PB5/TIM3_CH2/I2C1_SMBA/SPI1_MOSI/I2S1_SD/SPI3_MOSI/I2S3_SD/CAN2_RX/OTG_HS_ULPI_D7/FMC_SDCKE1/DCMI_D10/EVENTOUT)
EXT_GPIO4: U1.61(PB8/TIM2_CH1/TIM2_ETR/TIM4_CH3/TIM10_CH1/I2C1_SCL/CAN1_RX/SDIO_D4/DCMI_D6/EVENTOUT)
EXT_GPIO5: U1.62(PB9/TIM2_CH2/TIM4_CH4/TIM11_CH1/I2C1_SDA/SPI2_NSS/I2S2_WS/SAI1_FS_B/CAN1_TX/SDIO_D5/DCMI_D7/EVENTOUT)
EXT_GPIO6: U1.8(PC0/SAI1_MCLK_B/OTG_HS_ULPI_STP/FMC_SDNWE/EVENTOUT)
EXT_GPIO7: U1.9(PC1/SPI3_MOSI/I2S3_SD/SAI1_SD_A/SPI2_MOSI/I2S2_SD/EVENTOUT)
EXT_GPIO8: U1.10(PC2/SPI2_MISO/OTG_HS_ULPI_DIR/FMC_SDNE0/EVENTOUT)
EXT_GPIO9: U1.11(PC3/SPI2_MOSI/I2S2_SD/OTG_HS_ULPI_NXT/FMC_SDCKE0/EVENTOUT)
EXT_GPIO10: U1.14(PA0-WKUP(PA0)TIM2_CH1/TIM2_ETR/TIM5_CH1/TIM8_ETR/USART2_CTS/UART4_TX/EVENTOUT)
EXT_GPIO11: U1.15(PA1/TIM2_CH2/TIM5_CH2/USART2_RTS/UART4_RX/QUADSPI_BK1_IO3/SAI2_MCLK_B/EVENTOUT)
GND: C1.1 C2.1 C3.2 C4.2 C5.2 C6.2 C7.2 C8.2 C10.2 C11.2 C12.2 C13.2 C14.2 C19.2 R2.1 R4.1 U1.12(VSSA/VREF-) U1.18(VSS) U1.31(VSS) U1.47(VSS) U1.63(VSS)
I2C1_SCL: U1.58(PB6/TIM4_CH1/HDMI_CEC/I2C1_SCL/USART1_TX/CAN2_TX/QUADSPI_BK1_NCS/FMC_SDNE1/DCMI_D5/EVENTOUT)
I2C1_SDA: U1.59(PB7/TIM4_CH2/I2C1_SDA/USART1_RX/SPDIFRX_IN0/FMC_NL/DCMI_VSYNC/EVENTOUT)
INT_GPIO0: U1.26(PB0/TIM1_CH2N/TIM3_CH3/TIM8_CH2N/SPI3_MOSI/I2S3_SD/UART4_CTS/OTG_HS_ULPI_D1/SDIO_D1/EVENTOUT)
INT_GPIO1: U1.25(PC5/USART3_RX/SPDIFRX_IN3/FMC_SDCKE0/EVENTOUT)
INT_GPIO2: U1.24(PC4/I2S1_MCK/SPDIFRX_IN2/FMC_SDNE0/EVENTOUT)
INT_GPIO3: U1.23(PA7/TIM1_CH1N/TIM3_CH2/TIM8_CH1N/SPI1_MOSI/I2S1_SD/TIM14_CH1/FMC_SDNWE/EVENTOUT)
MCO1: U1.41(PA8/MCO1/TIM1_CH1/I2C3_SCL/USART1_CK/OTG_FS_SOF/EVENTOUT)
N$1: C19.1 U1.30(VCAP_1)
N$2: C12.1 U1.3(PC14-OSC32_IN(PC14)/EVENTOUT) X2.P$2
N$3: C8.1 L1.2 U1.13(VDDA/VREF+)
N$4: D1.C R5.1 U1.1(VBAT)
N$6: C11.1 U1.4(PC15-OSC32_OUT(PC15)/EVENTOUT) X2.P$1
N$9: C13.1 U1.6(PH1-OSC_OUT/EVENTOUT) X1.P$2
N$11: R3.1 R4.2 U1.27(PB1/TIM1_CH3N/TIM3_CH4/TIM8_CH3N/OTG_HS_ULPI_D2/SDIO_D2/EVENTOUT)
N$12: C10.1 R5.2
PWM_OUT1: U1.21(PA5/TIM2_CH1/TIM2_ETR/TIM8_CH1N/SPI1_SCK/I2S1_CK/OTG_HS_ULPI_CK/EVENTOUT)
PWM_OUT2: U1.22(PA6/TIM1_BKIN/TIM3_CH1/TIM8_BKIN/SPI1_MISO/I2S2_MCK/TIM13_CH1/DCMI_PIXCLK/EVENTOUT)
SPI2_BUSY: U1.40(PC9/MCO2/TIM3_CH4/TIM8_CH4/I2C3_SDA/I2S_CKIN/UART5_CTS/QUADSPI_BK1_IO0/SDIO_D1/DCMI_D3/EVENTOUT)
SPI2_DI: U1.35(PB14/TIM1_CH2N/TIM8_CH2N/SPI2_MISO/USART3_RTS/TIM12_CH1/OTG_HS_DM/EVENTOUT)
SPI2_DO: U1.36(PB15/RTC_REFIN/TIM1_CH3N/TIM8_CH3N/SPI2_MOSI/I2S2_SD/TIM12_CH2/OTG_HS_DP/EVENTOUT)
SPI2_SCK: U1.34(PB13/TIM1_CH1N/SPI2_SCK/I2S2_CK/USART3_CTS/CAN2_TX/OTG_HS_ULPI_D6/EVENTOUT)
SPI3_!CD: U1.2(PC13/EVENTOUT)
SPI3_DI: U1.52(PC11/SPI3_MISO/USART3_RX/UART4_RX/QUADSPI_BK2_NCS/SDIO_D3/DCMI_D4/EVENTOUT)
SPI3_DO: U1.53(PC12/I2C2_SDA/SPI3_MOSI/I2S3_SD/USART3_CK/UART5_TX/SDIO_CK/DCMI_D9/EVENTOUT)
SPI3_SCK: U1.51(PC10/SPI3_SCK/I2S3_CK/USART3_TX/UART4_TX/QUADSPI_BK1_IO1/SDIO_D2/DCMI_D8/EVENTOUT)
SWCLK: U1.49(PA14/JTCK-SWCLK/EVENTOUT)
SWDIO: U1.46(PA13/JTMS-SWDIO/EVENTOUT)
USART2_RX: U1.17(PA3/TIM2_CH4/TIM5_CH4/TIM9_CH2/SAI1_FS_A/USART2_RX/OTG_HS_ULPI_D0/EVENTOUT)
USART2_TX: U1.16(PA2/TIM2_CH3/TIM5_CH3/TIM9_CH1/USART2_TX/SAI2_SCK_B/EVENTOUT)
USB_DM: U1.44(PA11/TIM1_CH4/USART1_CTS/CAN1_RX/OTG_FS_DM/EVENTOUT)
USB_DP: U1.45(PA12/TIM1_ETR/USART1_RTS/SAI2_FS_B/CAN1_TX/OTG_FS_DP/EVENTOUT)
USB_VBUS: C2.2 U1.42(PA9/TIM1_CH2/I2C3_SMBA/SPI2_SCK/I2S2_CK/SAI1_SD_B/USART1_TX/DCMI_D0/EVENTOUT)
VDETECT: R3.2
Unconnected: U1.20(PA4/SPI1_NSS/I2S1_WS/SPI3_NSS/I2S3_WS/USART2_CK/OTG_HS_SOF/DCMI_HSYNC/EVENTOUT) U1.28(PB2-BOOT1(PB2)/TIM2_CH4/SAI1_SD_A/SPI3_MOSI/I2S3_SD/QUADSPI_CLK/OTG_HS_ULPI_D4/SDIO_CK/EVENTOUT) U1.29(PB10/TIM2_CH3/I2C2_SCL/SPI2_SCK/I2S2_CK/SAI1_SCK_A/USART3_TX/OTG_HS_ULPI_D3/EVENTOUT) U1.33(PB12/TIM1_BKIN/I2C2_SMBA/SPI2_NSS/I2S2_WS/SAI1_SCK_B/USART3_CK/CAN2_RX/OTG_HS_ULPI_D5/OTG_HS_ID/EVENTOUT) U1.38(PC7/TIM3_CH2/TIM8_CH2/FMPI2C1_SDA/SPI2_SCK/I2S2_CK/I2S3_MCK/SPDIFRX_IN1/USART6_RX/SDIO_D7/DCMI_D1/EVENTOUT) U1.39(PC8/TRACED0/TIM3_CH3/TIM8_CH3/UART5_RTS/USART6_CK/SDIO_D0/DCMI_D2/EVENTOUT) U1.43(PA10/TIM1_CH3/USART1_RX/OTG_FS_ID/DCMI_D1/EVENTOUT)

### Buses
INT_GPIO[0..3]
EXT_GPIO[0..11]

### Notes on the sheet
- Main Processing Unit | SCHLOA Main Board
- *Offset of part number is 200

### Library data of the parts
C1-C8 C10-C14 C19 = rcl:C-EU: CAPACITOR, European symbol; SPICEPREFIX: C
D1 = diode:DIODE-: DIODE
L1 = Fugu_RCL:INDUCOR
R1-R5 = Fugu_RCL:RESISTOR: Generic Registor
U1 = STM32F446RET6:STM32F446RET6: MCU 32-Bit STM32 ARM Cortex M4 RISC 512KB Flash 2.5V/3.3V 64-Pin LQFP Tray; AVAILABILITY: Unavailable; DESCRIPTION: MCU 32-Bit STM32 ARM Cortex M4 RISC 512KB Flash 2.5V/3.3V 64-Pin LQFP Tray; MF: STMicroelectronics; MP: STM32F446RET6; PACKAGE: LQFP-64 STMicroelectronics; PRICE: None
X1 X2 = adafruit:XTAL: Low cost SMT crystals, no capacitors included http://www.ladyada.net/library/eagle; SPICEPREFIX: X

## Module SPECTROMETER_UNIT
Ports: VCCIO(pwr) EN(in) TRG_OUT(out) CLK(in) ST(in) EOS(out) VIDEO(out) VDD(pwr) GND(pwr)
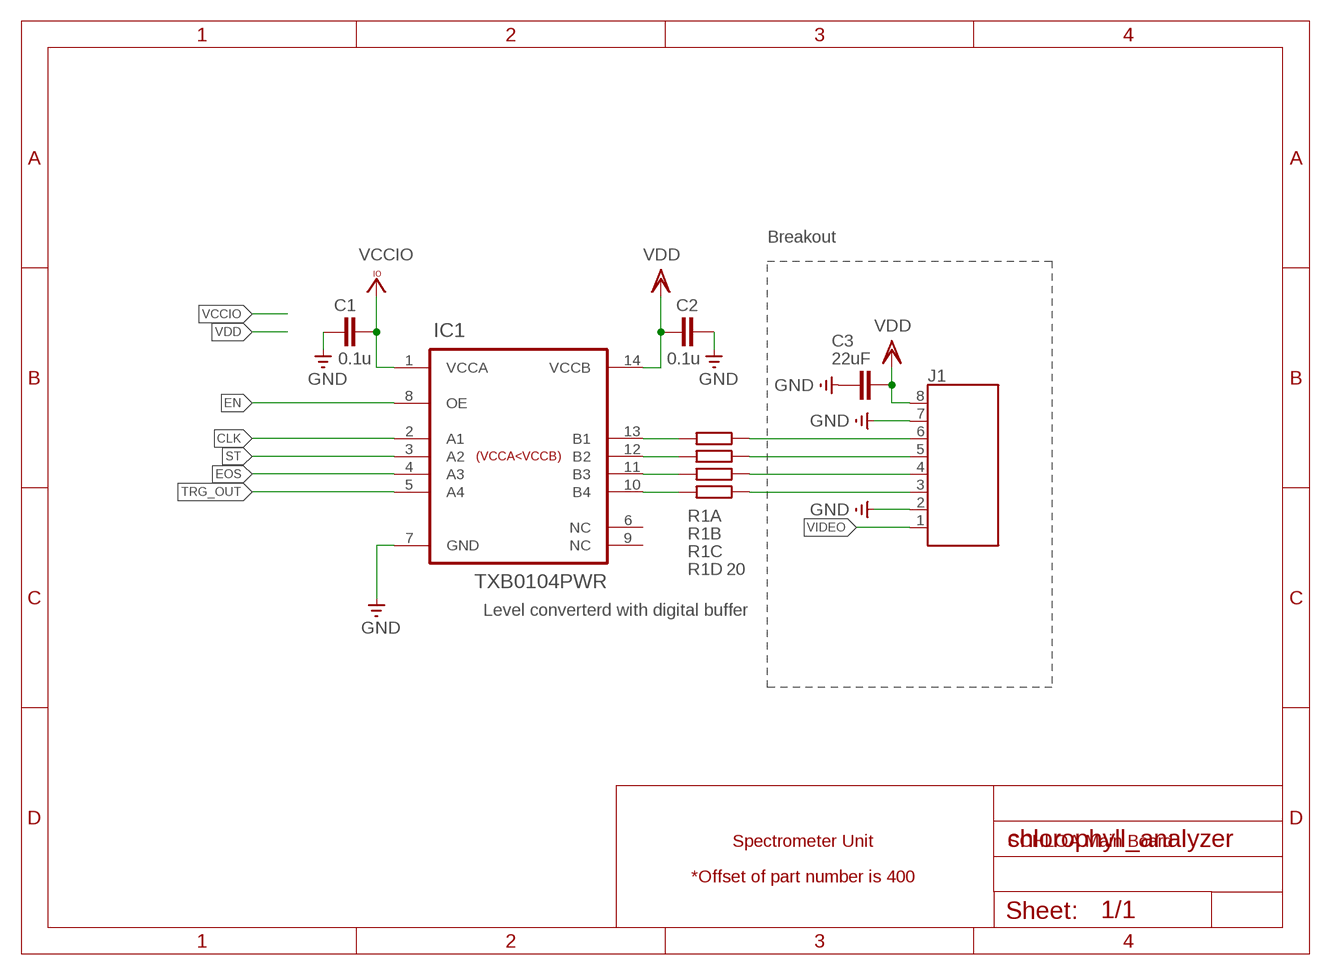
[diagram p5: schematic, module SPECTROMETER_UNIT, sheet 1]

### Parts
C1  0.1u  C-EUC0603K  [C0603K]
C2  0.1u  C-EUC0603K  [C0603K]
C3  22uF  C-EUC0603K  [C0603K]
IC1  TXB0104PWR  [SOP65P640X120-14N]
J1  687108183722  [687108183722]
R1  20  RESISTOR_ARRY1206  [RESCAXS80P320X160X60-8N]

### Nets
CLK: IC1.2(A1)
EN: IC1.8(OE)
EOS: IC1.4(A3)
GND: C1.1 C2.2 C3.2 IC1.7(GND) J1.2 J1.7
N$1: IC1.13(B1) R1.1
N$2: IC1.12(B2) R1.2
N$3: IC1.11(B3) R1.3
N$4: IC1.10(B4) R1.4
N$5: J1.6 R1.8
N$6: J1.5 R1.7
N$7: J1.4 R1.6
N$8: J1.3 R1.5
ST: IC1.3(A2)
TRG_OUT: IC1.5(A4)
VCCIO: C1.2 IC1.1(VCCA)
VDD: C2.1 C3.1 IC1.14(VCCB) J1.8
VIDEO: J1.1
Unconnected: IC1.6(NC) IC1.9(NC)

### Notes on the sheet
- Breakout
- Level converterd with digital buffer
- Spectrometer Unit | SCHLOA Main Board
- *Offset of part number is 400

### Library data of the parts
C1-C3 = rcl:C-EU: CAPACITOR, European symbol; SPICEPREFIX: C
IC1 = TXB0104PWR:TXB0104PWR: 4-BIT BIDIRECTIONAL VOLTAGE-LEVEL TRANSLATOR; AVAILABILITY: Unavailable; DESCRIPTION: 4-Bit Bidirectional Voltage-Level Shifter with Auto Direction Sensing and +/-15 kV ESD Protect 14-TSSOP -40 to 85; MF: Texas Instruments; MP: TXB0104PWR; PACKAGE: TSSOP-14 Texas Instruments; PRICE: None
J1 = Eagle_FPC_CONNECTOR_AND_FFC_CAB (rev18c):687108183722: 687108183722 WR-FPC 0.50mm SMT Horizontal Bottom Contact - Low Profile <http://katalog.we-online.de/media/images/v2/Family_WR-FPC_6871xx183722.jpg> Details see: http://katalog.we-online.de/en/em/FPC_0_5_SMT_ZIF_HORIZONTAL_BOTTOM_CONTACT_LOW_PROFILE_6871xx183722 Created by Yingchun,shan 2016 (C) Wurth Elektronik
R1 = Fugu_RCL:RESISTOR_ARRY

## Module BREAKOUT
Ports: VDD(pwr) GND(pwr) I2C_SDA(io) I2C_SCL(io) USART2_RX(io) USART2_TX(io) JTAG2_SWDIO(io) JTAG2_SWCLK(io) JTAG1_SWCLK(io) JTAG1_SWDIO(io) USART1_RX(io) USART1_TX(io) !NRST1(io) !NRST2(io) EXT_GPIO[0..11](io)
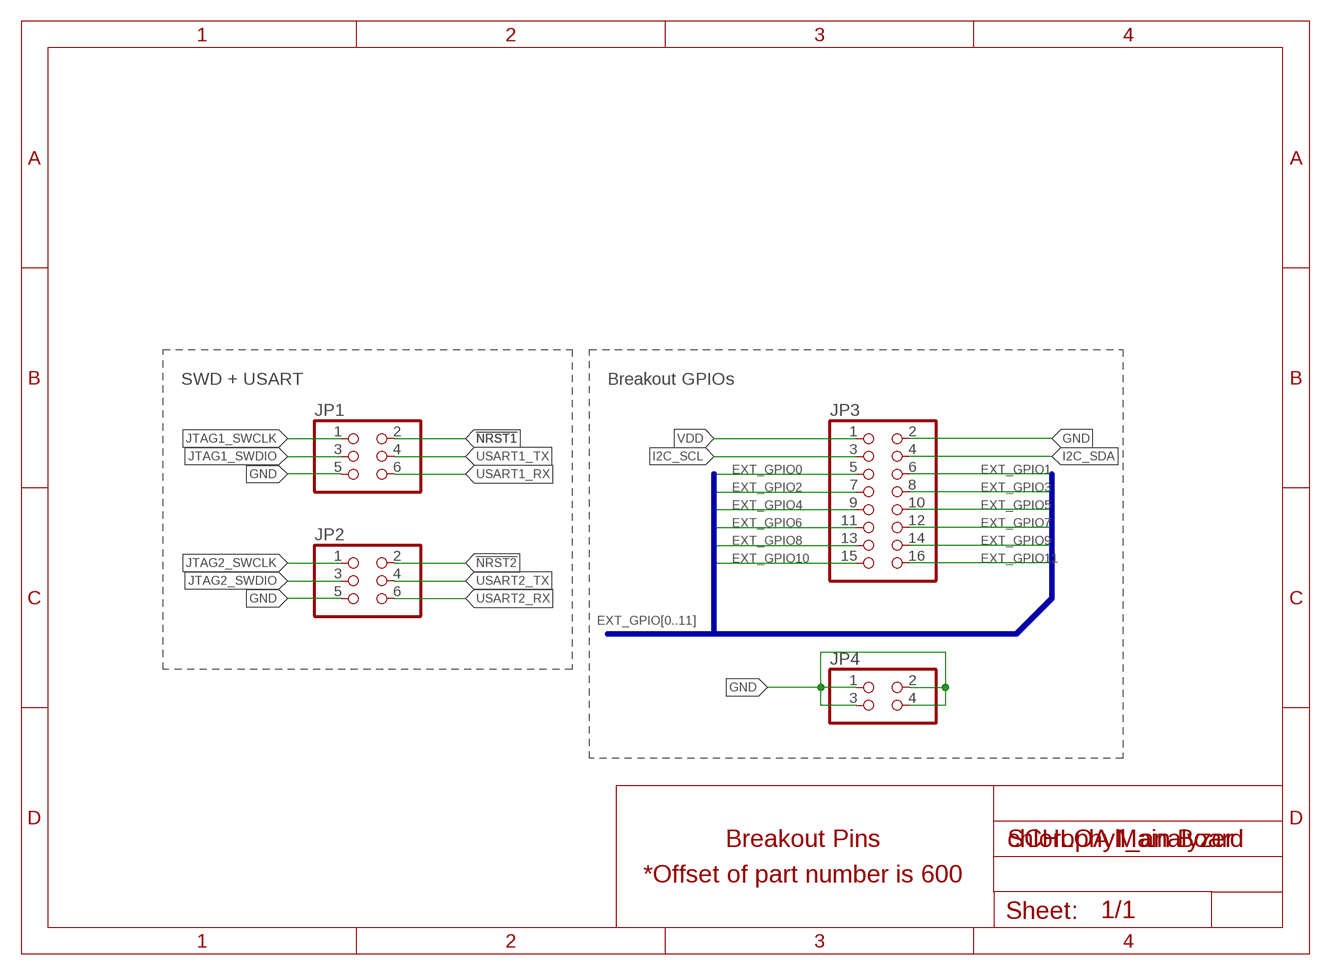
[diagram p6: schematic, module BREAKOUT, sheet 1]

### Parts
JP1  PINHD-2X3  [2X03]
JP2  PINHD-2X3  [2X03]
JP3  PINHD-2X8  [2X08]
JP4  PINHD-2X2  [2X02]

### Nets
!NRST1: JP1.2
!NRST2: JP2.2
EXT_GPIO0: JP3.5
EXT_GPIO1: JP3.6
EXT_GPIO2: JP3.7
EXT_GPIO3: JP3.8
EXT_GPIO4: JP3.9
EXT_GPIO5: JP3.10
EXT_GPIO6: JP3.11
EXT_GPIO7: JP3.12
EXT_GPIO8: JP3.13
EXT_GPIO9: JP3.14
EXT_GPIO10: JP3.15
EXT_GPIO11: JP3.16
GND: JP1.5 JP2.5 JP3.2 JP4.1 JP4.2 JP4.3 JP4.4
I2C_SCL: JP3.3
I2C_SDA: JP3.4
JTAG1_SWCLK: JP1.1
JTAG1_SWDIO: JP1.3
JTAG2_SWCLK: JP2.1
JTAG2_SWDIO: JP2.3
USART1_RX: JP1.6
USART1_TX: JP1.4
USART2_RX: JP2.6
USART2_TX: JP2.4
VDD: JP3.1

### Buses
EXT_GPIO[0..11]

### Notes on the sheet
- SWD + USART | Breakout GPIOs
- Breakout Pins | SCHLOA Main Board
- *Offset of part number is 600

### Library data of the parts
JP1 JP2 = pinhead:PINHD-2X3: PIN HEADER
JP3 = pinhead:PINHD-2X8: PIN HEADER
JP4 = pinhead:PINHD-2X2: PIN HEADER